# EAGLE design rk86-psu (EAGLE 7.7.0)
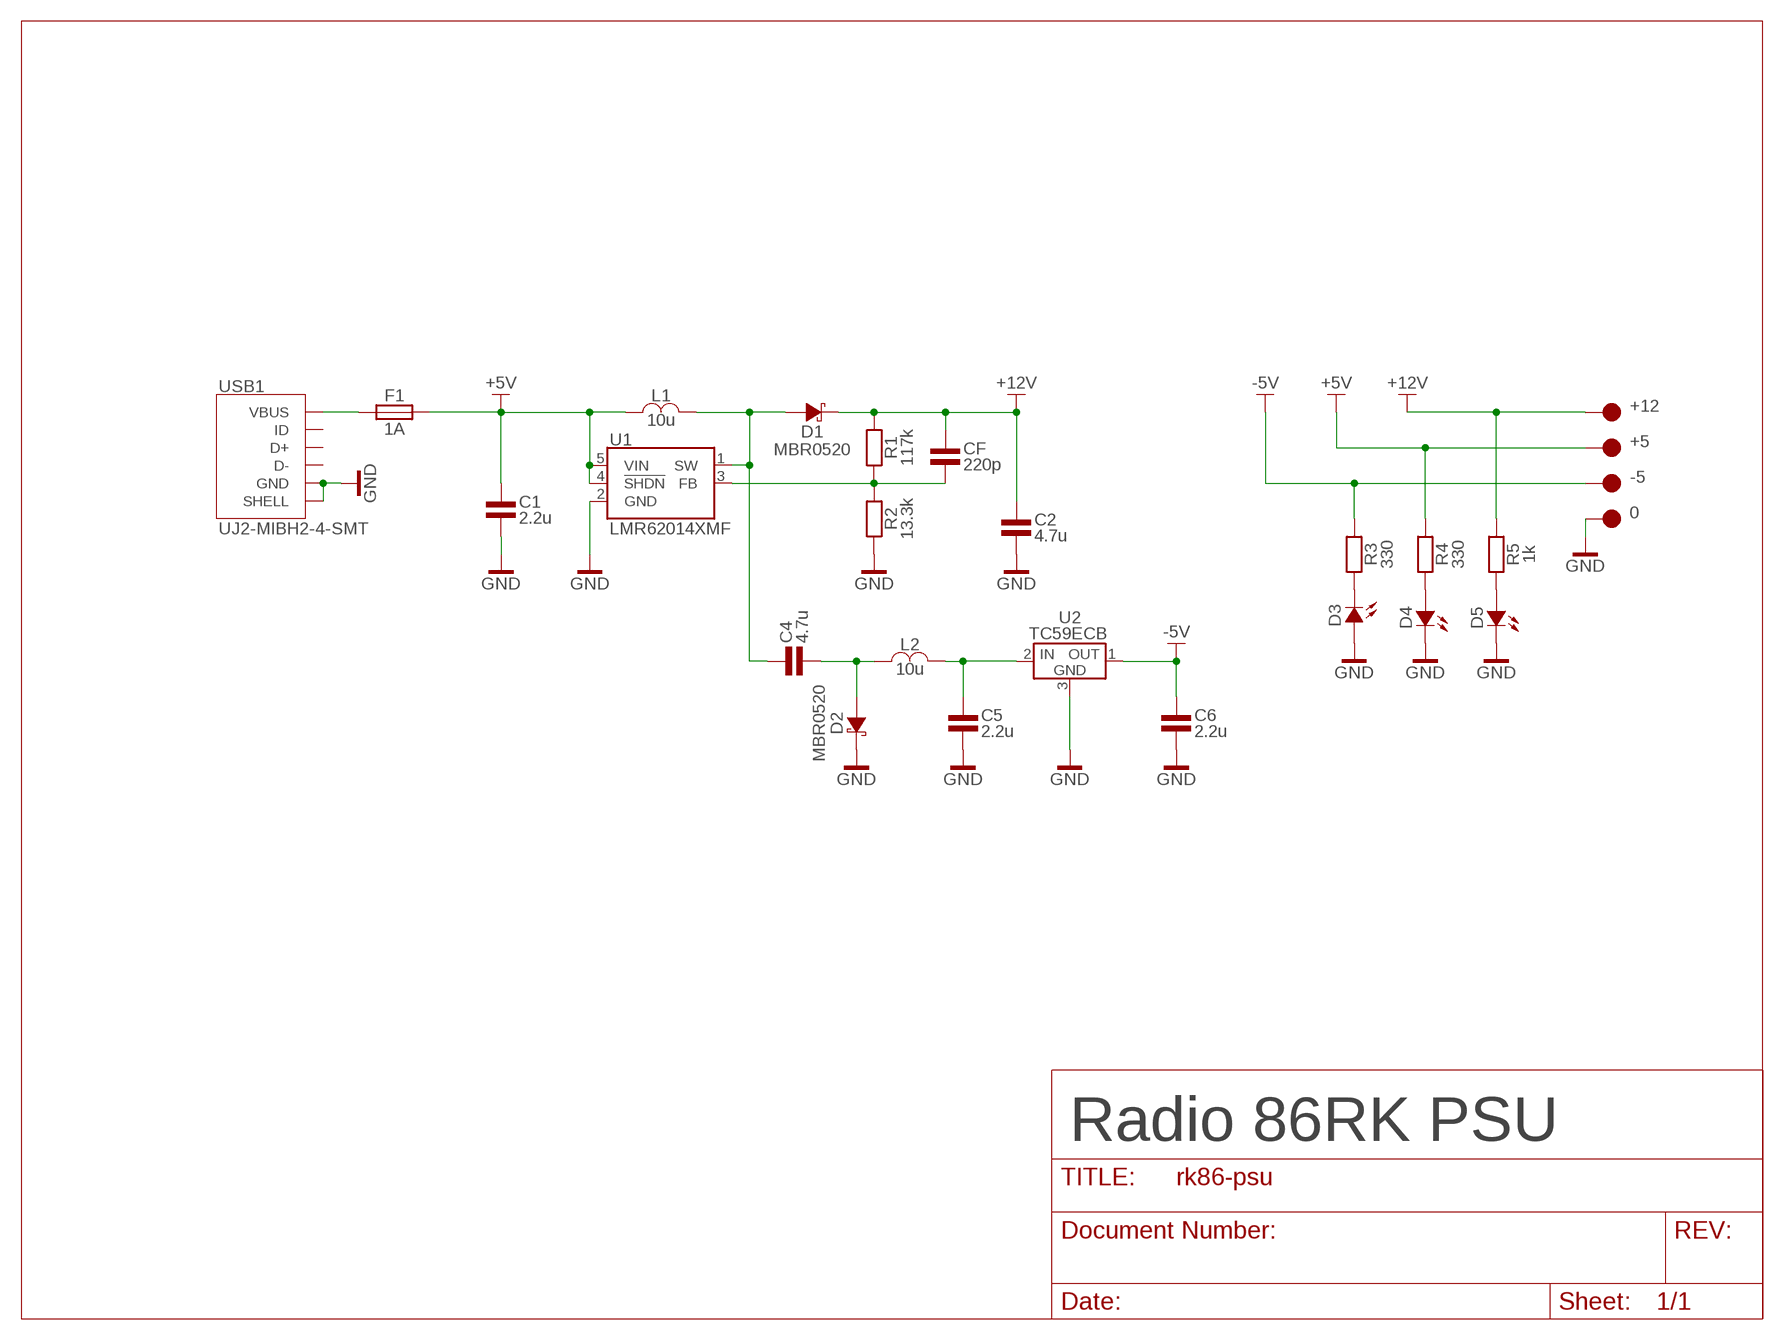
[diagram p0: schematic, sheet 1]

## Parts
0  WIREPAD_BOX  [WIREPAD_BOX]
+5  WIREPAD_BOX  [WIREPAD_BOX]
+12  WIREPAD_BOX  [WIREPAD_BOX]
-5  WIREPAD_BOX  [WIREPAD_BOX]
C1  2.2u  CAPACITOR_SMD1206  [1206]
C2  4.7u  CAPACITOR_SMD1206  [1206]
C4  4.7u  CAPACITOR_SMD1206  [1206]
C5  2.2u  CAPACITOR_SMD1206  [1206]
C6  2.2u  CAPACITOR_SMD1206  [1206]
CF  220p  CAPACITOR_SMD0805  [0805]
D1  MBR0520  [SOD123]
D2  MBR0520  [SOD123]
D3  LED0805  [0805POL]
D4  LED0805  [0805POL]
D5  LED0805  [0805POL]
F1  1A  FUSE1812  [1812]
L1  10u  INDUCTOR_FIXEDSRN6045TA  [BOUNRNS_SRN6045TA]
L2  10u  INDUCTOR_FIXEDSRN6045TA  [BOUNRNS_SRN6045TA]
R1  117k  RESISTOR0805  [0805]
R2  13.3k  RESISTOR0805  [0805]
R3  330  RESISTOR0805  [0805]
R4  330  RESISTOR0805  [0805]
R5  1k  RESISTOR0805  [0805]
U1  LMR62014XMF  [SOT23-5]
U2  TC59ECB  [SOT23-3]
USB1  UJ2-MIBH2-4-SMT  USBUJ2-MIBH2-4-SMT  [UJ2-MIBH2-4-SMT]

## Nets
+5V: +5.P$1 C1.2 F1.P$2 L1.P$1 R4.2 U1.4(!SHDN) U1.5(VIN)
+12V: +12.P$1 C2.2 CF.2 D1.K R1.2 R5.2
-5V: -5.P$1 C6.2 R3.2 U2.1(OUT)
GND: 0.P$1 C1.1 C2.1 C5.1 C6.1 D2.K D3.A D4.K D5.K R2.1 U1.2(GND) U2.3(GND) USB1.5(GND) USB1.S1(SHELL) USB1.S2(SHELL) USB1.S3(SHELL) USB1.S4(SHELL) USB1.S5(SHELL)
N$1: CF.1 R1.1 R2.2 U1.3(FB)
N$2: C4.2 D1.A L1.P$2 U1.1(SW)
N$3: C4.1 D2.A L2.P$1
N$4: C5.2 L2.P$2 U2.2(IN)
N$5: F1.P$1 USB1.1(VBUS)
N$6: D3.K R3.1
N$7: D4.A R4.1
N$8: D5.A R5.1
Unconnected: USB1.2(D-) USB1.3(D+) USB1.4(ID)

## Notes on the sheet
- Radio 86RK PSU

## Library data of the parts
0 +5 +12 -5 = 1_eagle_lib:WIREPAD: Pad for soldered wire
C1 C2 C4-C6 CF = 1_eagle_lib:CAPACITOR_SMD
D1 D2 = 1_eagle_lib:MBR0520: SCHOTTKY DIODE
D3-D5 = 1_eagle_lib:LED: LED
F1 = 1_eagle_lib:FUSE: Fuse
L1 L2 = 1_eagle_lib:INDUCTOR_FIXED: Fixed Inductors
R1-R5 = 1_eagle_lib:RESISTOR: Vishay CMF Metal Film Resistors, Axial, Industrial, Precision
U1 = 1_eagle_lib:LMR62014: LMR62014 SIMPLE SWITCHER® 20Vout, 1.4A Step-Up Voltage Regulator in SOT-23
U2 = 1_eagle_lib:TC59: Low Dropout, Negative Output Voltage Regulator
USB1 = 1_eagle_lib:USB: USB connector

## Board
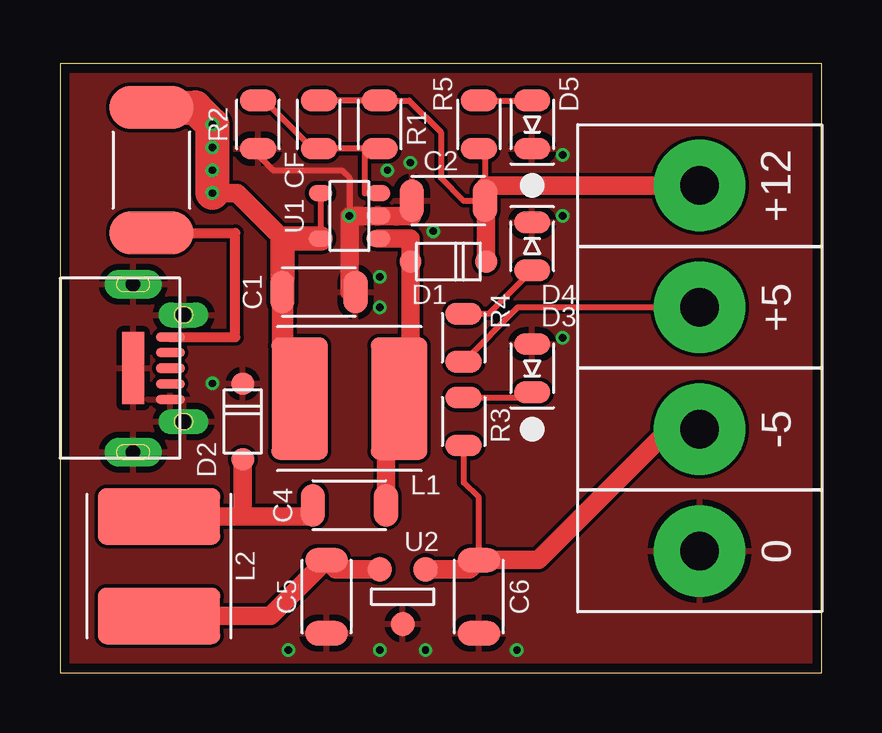
[diagram p1: board, top side]
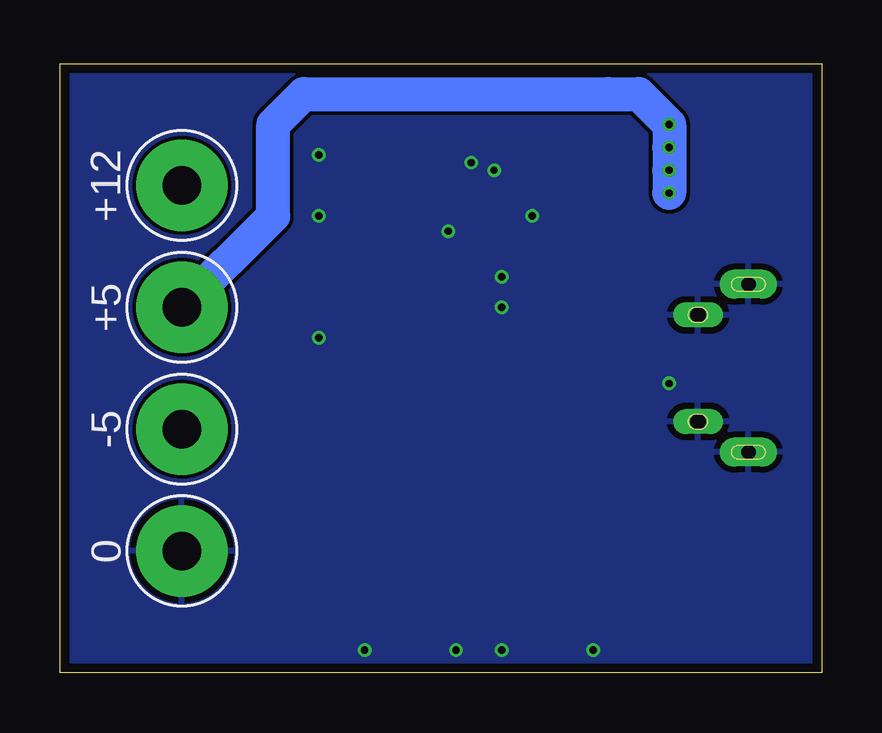
[diagram p2: board, bottom side, seen from below]

Size 31.75 x 25.4 mm. Coordinates in mm from the lower left corner, seen from the top.
Outline: 0,0 31.75,0 31.75,25.4 0,25.4 0,0
Copper layers (1*16): Top 0.035559375mm / dielectric 1.6mm / Bottom 0.035559375mm
Design rules "oshpark-2layer-tented": minimum track width 6mil, minimum drill 10mil, track to track 6mil, track to pad 6mil, pad to pad 6mil, via to via 6mil, smd to smd 6mil, copper to edge 15mil, drill to drill 6mil, minimum pad ring 5mil, minimum via ring 5mil, stop-mask expansion 2.5mil, vias tented up to drill 20mil, thermal gap 10mil

### Footprints (pad centres in the part's own frame; a part is rotated, then mirrored left to right if it is on the bottom)
WIREPAD_BOX = drill 1.6 pad 3.81: P$1 0,0
1206 = smd 1.016 x 1.778: 1 -1.524,0; 2 1.524,0
0805 = smd 0.914 x 1.524: 1 -1.003,0; 2 1.003,0
SOD123 = smd 0.9 x 0.95: A -1.575,0; K 1.575,0
0805POL = smd 0.914 x 1.524: A -1.003,0; K 1.003,0
1812 = smd 1.78 x 3.5: P$1 -2.615,0; P$2 2.615,0
BOUNRNS_SRN6045TA = smd 2.35 x 5.1: P$1 2.075,0; P$2 -2.075,0
SOT23-5 = smd 0.7 x 1: 1 -0.95,-1.2; 2 0,-1.2; 3 0.95,-1.2; 4 0.95,1.2; 5 -0.95,1.2
SOT23-3 = smd 1.016 x 1.016: 1 -0.953,-1.143; 2 0.953,-1.143; 3 0,1.143
UJ2-MIBH2-4-SMT = smd 1.2 x 0.4: 1 4.6,1.3; 2 4.6,0.65; 3 4.6,0; 4 4.6,-0.65; 5 4.6,-1.3 | drill 0.6 pad 1.2 long: S1 3.05,3.5; S2 3.05,-3.5 | drill 0.65 pad 1.05 long: S3 5.15,2.225; S4 5.15,-2.225 | smd 0.9 x 3: S5 3.05,0

### Placement (x,y rotation side)
0  26.67,5.08 270 top
+5  26.67,15.24 270 top
+12  26.67,20.32 270 top
-5  26.67,10.16 270 top
C1  10.79,15.88 180 top
C2  16.19,19.68 0 top
C4  12.06,6.99 0 top
C5  11.11,3.17 90 top
C6  17.46,3.17 90 top
CF  10.79,22.86 90 top
D1  16.19,17.14 0 top
D2  7.62,10.48 90 top
D3  19.68,12.7 270 top
D4  19.68,17.78 90 top
D5  19.68,22.86 270 top
F1  3.81,20.95 90 top
L1  12.06,11.43 180 top
L2  4.13,4.45 90 top
R1  13.34,22.86 90 top
R2  8.26,22.86 90 top
R3  16.83,10.48 270 top
R4  16.83,13.97 270 top
R5  17.46,22.86 270 top
U1  12.06,19.05 90 top
U2  14.29,3.17 180 top
USB1  0,12.7 0 top

### Tracks (layer width: path | path; a pad name or v marks a point on that pad's centre or on a via)
+5V  (via drill 0.3)
  Top 0.254: U1.4 U1.5 | R4.2 19.1,15.24 +5.P$1
  Top 0.762: L1.P$1 9.27,12.15 | 9.27,15.24 9.27,16.51 9.27,18.11 7.38,20 v6.35,20
  Top 0.813: 9.27,16.51 C1.2 9.27,15.24
  Top 0.889: 9.27,12.15 9.27,15.24
  Top 1.016: U1.5 9.27,18.1 9.27,16.51
  Top 1.422: F1.P$2 5.64,23.57 v6.35,22.86 v6.35,20
  Bottom 1.422: +5.P$1 22.86,19.05 22.86,22.86 21.59,24.13 8.89,24.13 7.62,24.13 6.99,23.5 v6.35,22.86 v6.35,21.91 v6.35,20.95 v6.35,20
+12V
  Top 0.254: CF.2 R1.2 14.55,23.86 15.88,22.54 15.88,20.64 16.83,19.68 C2.2 17.72,21.6 R5.2
  Top 0.762: D1.K 17.77,19.63 | 17.77,19.63 C2.2 | +12.P$1 17.77,20.32 17.77,19.63
-5V
  Top 0.254: C6.2 17.46,7.3 16.83,7.94 R3.2
  Top 0.762: U2.1 17.08,4.32 C6.2 19.94,4.7 25.4,10.16 -5.P$1
GND  (via drill 0.3)
  Top 0.254: R2.1 8.26,21.59 8.89,20.95 11.75,20.95 12.06,20.64 v12.06,19.05
  Top 0.762: C1.1 12.06,15.88 12.06,17.78 v12.06,19.05 U1.2 13.97,19.05 14.67,19.05 C2.1
  other vias: 13.34,16.51 13.34,15.24 13.65,20.95 20.95,21.59 20.95,19.05 20.95,13.97 15.24,0.95 13.34,0.95 9.53,0.95 19.05,0.95 6.35,12.06 15.56,18.41 14.61,21.27
  pour Bottom: 0,0 31.75,0 31.75,25.4 0,25.4
  pour Top: 31.75,25.4 0,25.4 0,0 31.75,0
N$1
  Top 0.254: R1.1 13.27,21.79 12.7,21.79 12.7,20 U1.3 | 13.27,21.86 CF.1 10.53,21.86 8.52,23.86 R2.2
  Top 0.762: R1.1 13.27,21.86
N$2
  Top 0.762: U1.1 13.66,18.1 14.61,18.1 D1.A 14.62,11.91 L1.P$2 13.59,11.43 C4.2
  Top 0.813: L1.P$2 13.59,11.43
N$3
  Top 0.762: C4.1 10.49,6.99 10.49,6.52 8.89,6.52 | 5.71,6.99 L2.P$1 8.89,6.52 | D2.A 7.62,6.52 8.89,6.52
N$4
  Top 0.762: 5.71,1.91 L2.P$2 8.78,2.37 C5.2 11.49,4.32 U2.2
N$5
  Top 0.406: USB1.1 7.3,14 7.3,18.34 F1.P$1
N$6
  Top 0.254: R3.1 19.47,11.48 D3.K
N$7
  Top 0.254: R4.1 17.88,14.97 D4.A
N$8
  Top 0.254: R5.1 D5.A